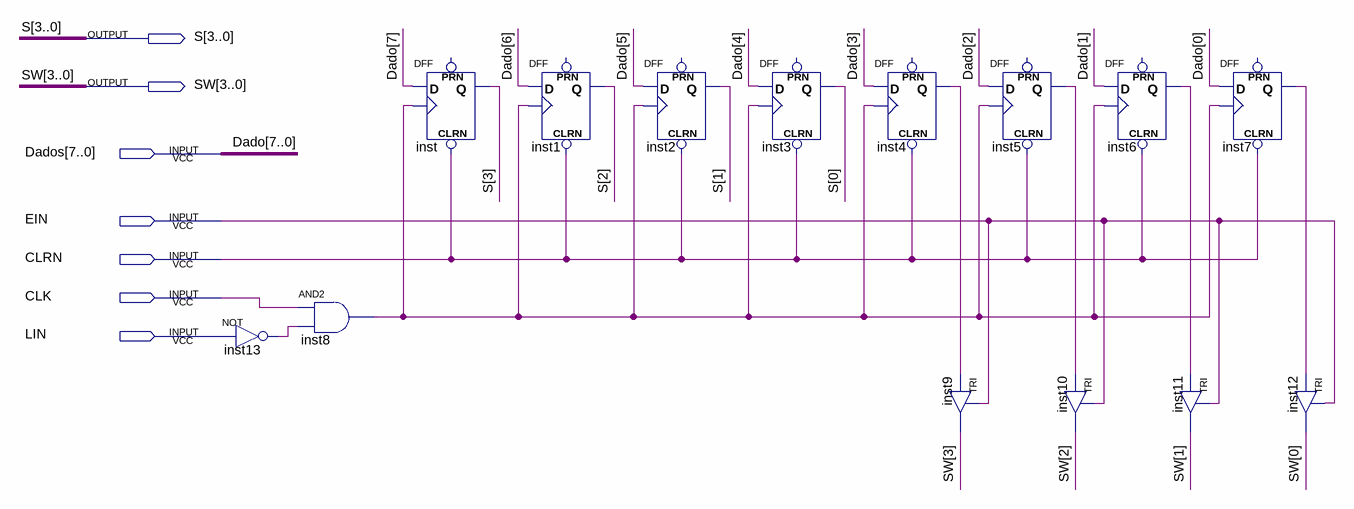
[diagram p0: schematic sheet]
// Quartus schematic Registrador_Instrucoes.bdf as structural Verilog: 14 symbols, 7 pins
module Registrador_Instrucoes (
  input  [7:0] Dados,
  input  EIN,
  input  CLRN,
  input  CLK,
  input  LIN,
  output [3:0] S,
  output [3:0] SW
);

  wire inst4_q, inst5_q, inst6_q, inst7_q, inst8_out, inst13_out;

  not inst13 (inst13_out, LIN);
  and inst8 (inst8_out, CLK, inst13_out);
  DFF inst (.CLRN(CLRN), .CLK(inst8_out), .D(Dados[7]), .Q(S[3]));  // open: PRN
  DFF inst1 (.CLRN(CLRN), .CLK(inst8_out), .D(Dados[6]), .Q(S[2]));  // open: PRN
  DFF inst2 (.CLRN(CLRN), .CLK(inst8_out), .D(Dados[5]), .Q(S[1]));  // open: PRN
  DFF inst3 (.CLRN(CLRN), .CLK(inst8_out), .D(Dados[4]), .Q(S[0]));  // open: PRN
  DFF inst4 (.CLRN(CLRN), .CLK(inst8_out), .D(Dados[3]), .Q(inst4_q));  // open: PRN
  TRI inst9 (.IN(inst4_q), .OE(EIN), .OUT(SW[3]));
  DFF inst5 (.CLRN(CLRN), .CLK(inst8_out), .D(Dados[2]), .Q(inst5_q));  // open: PRN
  TRI inst10 (.IN(inst5_q), .OE(EIN), .OUT(SW[2]));
  DFF inst6 (.CLRN(CLRN), .CLK(inst8_out), .D(Dados[1]), .Q(inst6_q));  // open: PRN
  TRI inst11 (.IN(inst6_q), .OE(EIN), .OUT(SW[1]));
  DFF inst7 (.CLRN(CLRN), .CLK(inst8_out), .D(Dados[0]), .Q(inst7_q));  // open: PRN
  TRI inst12 (.IN(inst7_q), .OE(EIN), .OUT(SW[0]));

  // Other names for the same wires on the sheet: Dado[7:0] = Dados
endmodule
